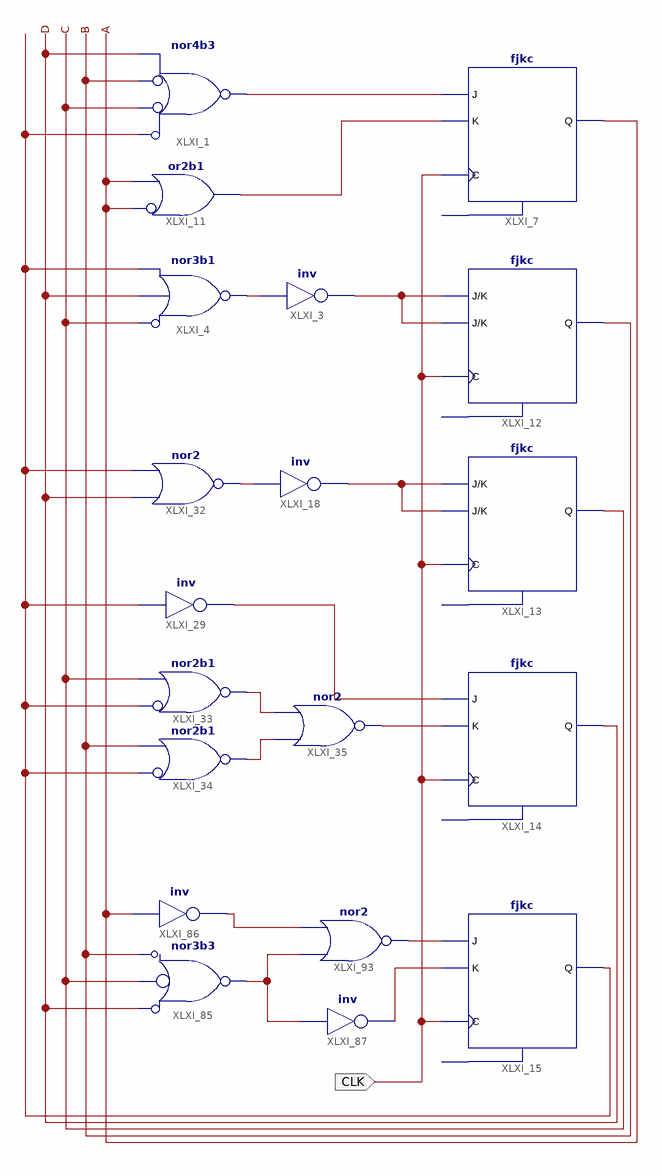
[diagram p0: schematic sheet 1]
// Xilinx ISE schematic JK.sch (artix7) as structural Verilog: 19 symbols, 1 ports
module JK (
  input  CLK
);

  wire A, B, C, D, E, XLXN_141, XLXN_143, XLXN_144, XLXN_146, XLXN_147, XLXN_157, XLXN_158, XLXN_159,
       XLXN_160, XLXN_161, XLXN_242, XLXN_243, XLXN_245, XLXN_246;

  nor XLXI_1 (XLXN_144, ~E, ~C, ~B, D);  // nor4b3
  fjkc XLXI_7 (.C(CLK), .J(XLXN_144), .K(XLXN_143), .Q(A));  // open: CLR
  nor XLXI_4 (XLXN_141, ~C, D, E);  // nor3b1
  not XLXI_3 (XLXN_146, XLXN_141);
  or XLXI_11 (XLXN_143, ~A, A);  // or2b1
  fjkc XLXI_12 (.C(CLK), .J(XLXN_146), .K(XLXN_146), .Q(B));  // open: CLR
  fjkc XLXI_13 (.C(CLK), .J(XLXN_157), .K(XLXN_157), .Q(C));  // open: CLR
  not XLXI_18 (XLXN_157, XLXN_147);
  nor XLXI_32 (XLXN_147, D, E);
  nor XLXI_33 (XLXN_160, ~E, C);  // nor2b1
  nor XLXI_34 (XLXN_161, ~E, B);  // nor2b1
  nor XLXI_35 (XLXN_159, XLXN_161, XLXN_160);
  not XLXI_29 (XLXN_158, E);
  fjkc XLXI_15 (.C(CLK), .J(XLXN_246), .K(XLXN_245), .Q(E));  // open: CLR
  not XLXI_87 (XLXN_245, XLXN_243);
  nor XLXI_85 (XLXN_243, ~D, ~C, ~B);  // nor3b3
  not XLXI_86 (XLXN_242, A);
  nor XLXI_93 (XLXN_246, XLXN_243, XLXN_242);
  fjkc XLXI_14 (.C(CLK), .J(XLXN_158), .K(XLXN_159), .Q(D));  // open: CLR
endmodule
